# EAGLE design ESP32-LedTreiber_V110 (EAGLE 9.6.2)
AUTOREN: Hardi, Jürgen & Dominik; DATUM: 2021-04-05; PROJEKT: MLL - ESP32-Adapter; VERSION: 1.1
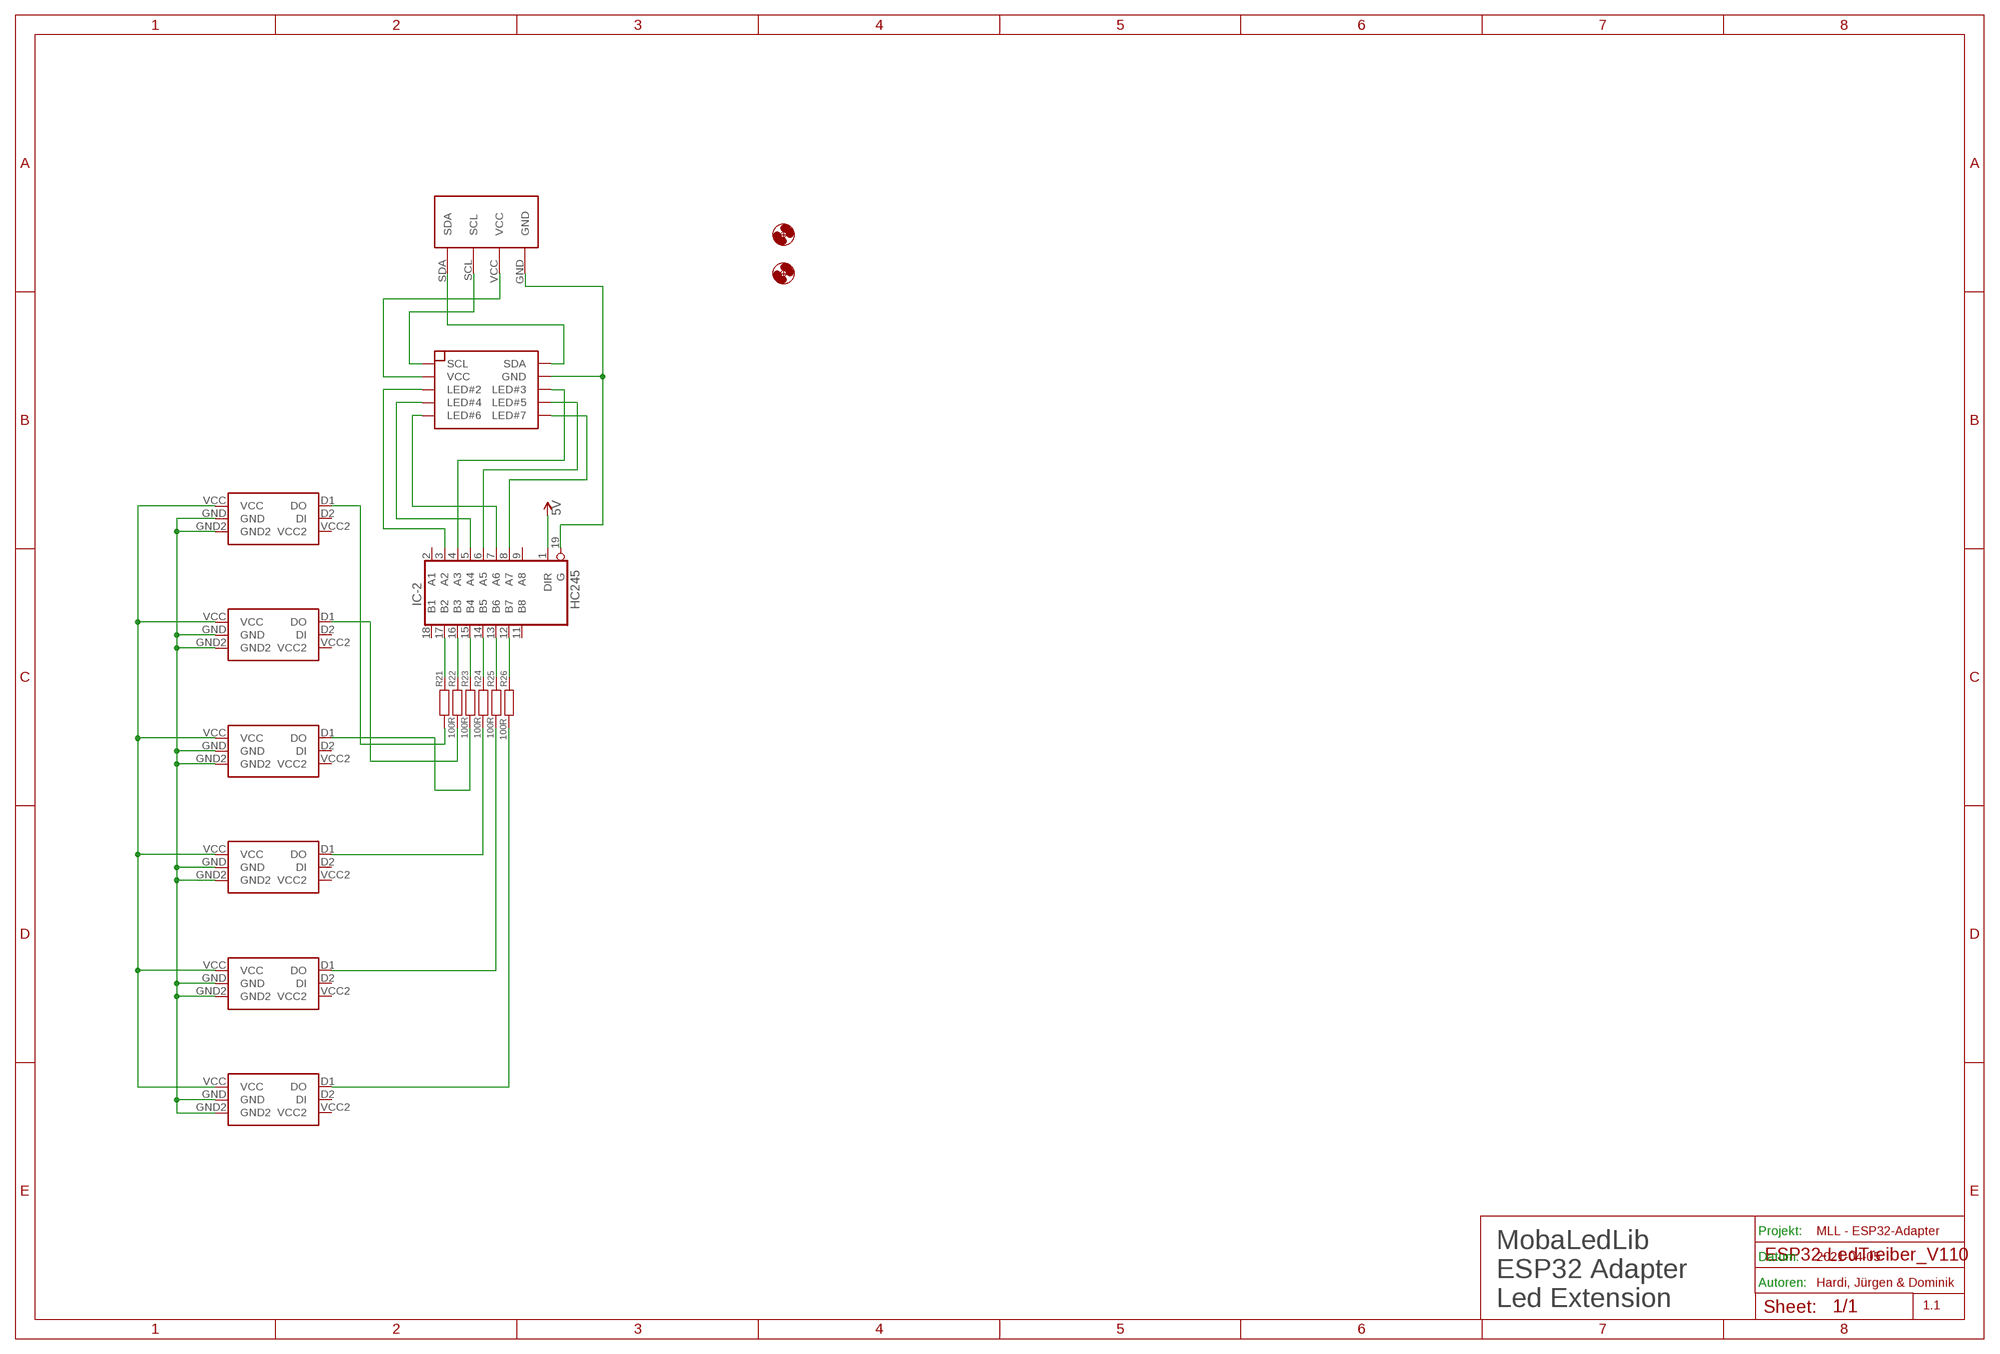
[diagram p0: schematic, sheet 1]

## Parts
H3  MOUNT-HOLE2.8  [2,8]
H4  MOUNT-HOLE2.8  [2,8]
IC-2  HC245  74AC245N  [DIL20]
LED_IN  MLL-32-EXT10  [IDC10]
OUT2A  LED-BUS-OUTPUT  [IDC6]
OUT3A  LED-BUS-OUTPUT  [IDC6]
OUT4A  LED-BUS-OUTPUT  [IDC6]
OUT5A  LED-BUS-OUTPUT  [IDC6]
OUT6A  LED-BUS-OUTPUT  [IDC6]
OUT7A  LED-BUS-OUTPUT  [IDC6]
R21  100R  RESISTOR-1/8W  [R-0.125-6,35]
R22  100R  RESISTOR-1/8W  [R-0.125-6,35]
R23  100R  RESISTOR-1/8W  [R-0.125-6,35]
R24  100R  RESISTOR-1/8W  [R-0.125-6,35]
R25  100R  RESISTOR-1/8W  [R-0.125-6,35]
R26  100R  RESISTOR-1/8W  [R-0.125-6,35]
U$7  I2C  [I2C-4]

## Nets
DO1: OUT2A.D1(DO) R21.1
DO9: OUT6A.D1(DO) R25.1
DO10: OUT5A.D1(DO) R24.1
DO11: OUT4A.D1(DO) R23.1
DO12: OUT3A.D1(DO) R22.1
GND: IC-2.19(G) LED_IN.4(GND) OUT2A.GND OUT2A.GND2 OUT3A.GND OUT3A.GND2 OUT4A.GND OUT4A.GND2 OUT5A.GND OUT5A.GND2 OUT6A.GND OUT6A.GND2 OUT7A.GND OUT7A.GND2 U$7.GND
LB#2: IC-2.3(A2) LED_IN.5(LED#2)
LB#3: IC-2.4(A3) LED_IN.6(LED#3)
LB#4: IC-2.5(A4) LED_IN.7(LED#4)
LB#5: IC-2.6(A5) LED_IN.8(LED#5)
LB#6: IC-2.7(A6) LED_IN.9(LED#6)
LB#7: IC-2.8(A7) LED_IN.10(LED#7)
N$6: OUT7A.D1(DO) R26.1
N$47: IC-2.17(B2) R21.2
N$62: IC-2.16(B3) R22.2
N$76: IC-2.15(B4) R23.2
N$77: IC-2.14(B5) R24.2
N$78: IC-2.13(B6) R25.2
N$79: IC-2.12(B7) R26.2
SCL: LED_IN.1(SCL) U$7.SCL
SDA: LED_IN.2(SDA) U$7.SDA
VCC_1: IC-2.1(DIR) LED_IN.3(VCC) OUT2A.VCC OUT3A.VCC OUT4A.VCC OUT5A.VCC OUT6A.VCC OUT7A.VCC U$7.VCC ; supply symbol labelled 5V
Unconnected: IC-2.2(A1) IC-2.9(A8) IC-2.11(B8) IC-2.18(B1) OUT2A.D2(DI) OUT3A.D2(DI) OUT4A.D2(DI) OUT5A.D2(DI) OUT6A.D2(DI) OUT7A.D2(DI)

## Notes on the sheet
- Projekt:
- Datum:
- Autoren:
- MobaLedLib 
  ESP32 Adapter
  Led Extension

## Power pins joined to a net without a drawn wire
GND: IC-2.10(GND)
VCC2: OUT2A.VCC2 OUT3A.VCC2 OUT4A.VCC2 OUT5A.VCC2 OUT6A.VCC2 OUT7A.VCC2
VCC_1: IC-2.20(VCC)

## Library data of the parts
H3 H4 = holes:MOUNT-HOLE: MOUNTING HOLE with drill center marker
IC-2 = 0 ProSaH-74xx:74*245: Octal BUS TRANSCEIVER, 3-state
LED_IN = MLL-Dominik-Hardi:MLL-32-EXT10
OUT2A OUT3A OUT4A OUT5A OUT6A OUT7A = MLL-Dominik-Hardi:LED-BUS-OUTPUT
R21-R26 = 0 ProSaH-PASSIV:RESISTOR
U$7 = MLL-Dominik-Hardi:I2C

## Board
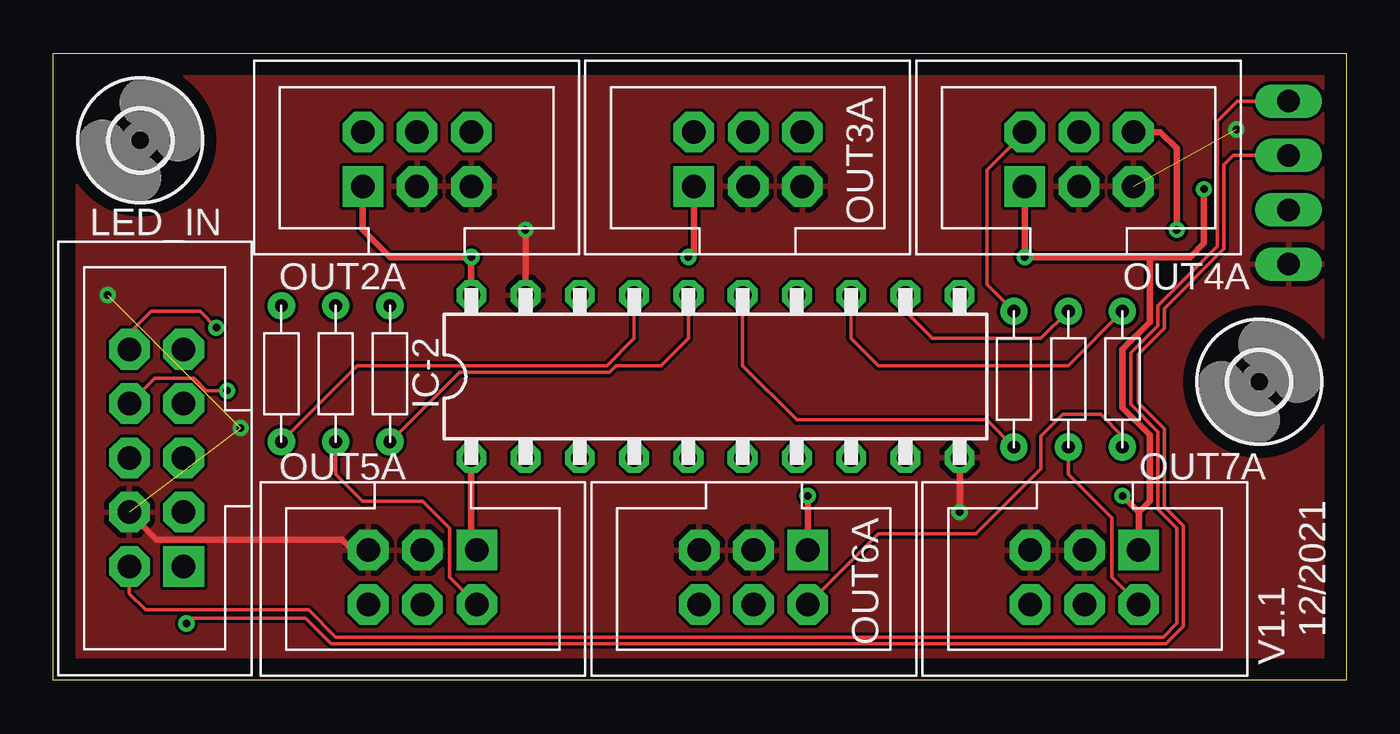
[diagram p1: board, top side]
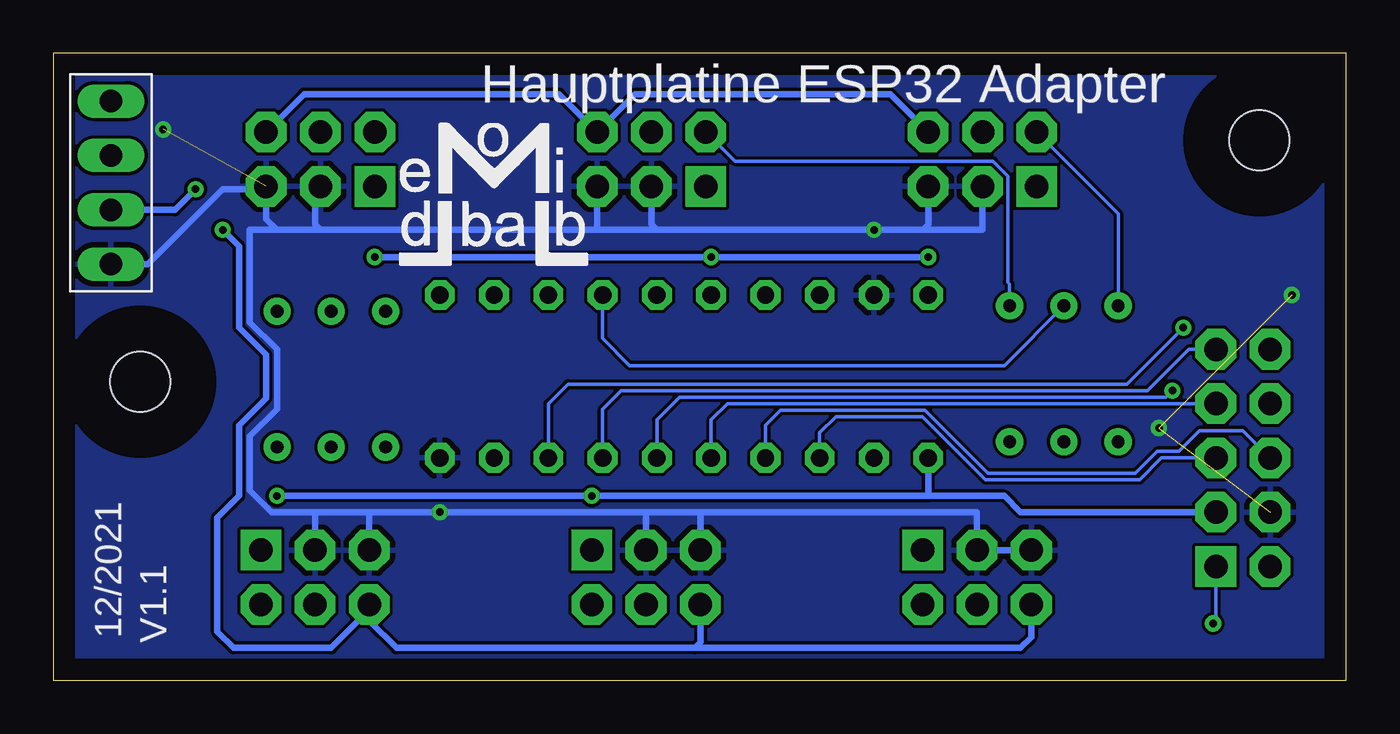
[diagram p2: board, bottom side, seen from below]

Size 60.5 x 29.34 mm. Coordinates in mm from the lower left corner, seen from the top.
Outline: 0,29.34 60.5,29.34 60.5,0 0,0 0,29.34
Copper layers (1*16): Top 0.035mm / dielectric 1.5mm / Bottom 0.035mm
Design rules "default *": minimum track width 6mil, minimum drill 0.35mm, track to track 6mil, track to pad 6mil, pad to pad 6mil, via to via 6mil, smd to smd 6mil, copper to edge 40mil, drill to drill 6mil, minimum pad ring 10mil, minimum via ring 8mil, stop-mask expansion 4mil, vias tented up to drill 0.5mm, thermal gap 10mil

### Footprints (pad centres in the part's own frame; a part is rotated, then mirrored left to right if it is on the bottom)
2,8 = hole 2.8: 0,0
DIL20 = drill 0.813 pad 1.397 octagon: 1 -11.43,-3.81; 2 -8.89,-3.81; 3 -6.35,-3.81; 4 -3.81,-3.81; 5 -1.27,-3.81; 6 1.27,-3.81; 7 3.81,-3.81; 8 6.35,-3.81; 9 8.89,-3.81; 10 11.43,-3.81; 11 11.43,3.81; 12 8.89,3.81; 13 6.35,3.81; 14 3.81,3.81; 15 1.27,3.81; 16 -1.27,3.81; 17 -3.81,3.81; 18 -6.35,3.81; 19 -8.89,3.81; 20 -11.43,3.81
IDC10 = drill 1.1 pad 1.9 square: 1 -5.08,-1.27 | drill 1.1 pad 1.9 octagon: 2 -5.08,1.27; 3 -2.54,-1.27; 4 -2.54,1.27; 5 0,-1.27; 6 0,1.27; 7 2.54,-1.27; 8 2.54,1.27; 9 5.08,-1.27; 10 5.08,1.27
IDC6 = drill 1.1 pad 1.9 octagon: D1 -2.54,1.27; D2 0,1.27; GND 0,-1.27; GND2 2.54,-1.27; VCC2 2.54,1.27 | drill 1.1 pad 1.9 square: VCC -2.54,-1.27
R-0.125-6,35 = drill 0.6 pad 1.27: 1 -3.81,0; 2 2.54,0
I2C-4 = drill 1.05 long: GND 0,-3.81; SCL 0,1.27; SDA 0,3.81; VCC 0,-1.27

### Placement (x,y rotation side)
H3  4.06,25.27 0 top
H4  56.44,13.97 0 top
IC-2  30.99,14.22 0 top
LED_IN  4.83,10.41 90 top
OUT2A  17.02,24.38 0 top
OUT3A  32.51,24.38 0 top
OUT4A  48.01,24.38 0 top
OUT5A  17.27,4.83 180 top
OUT6A  32.77,4.83 180 top
OUT7A  48.26,4.83 180 top
R21  10.67,13.72 270 top
R22  15.75,13.72 270 top
R23  44.96,13.46 270 top
R24  13.21,14.99 90 top
R25  50.04,14.73 90 top
R26  47.5,14.73 90 top
U$7  57.81,23.29 0 bottom

### Tracks (layer width: path | path; a pad name or v marks a point on that pad's centre or on a via)
DO1
  Bottom 0.152: OUT2A.D1 10.67,21.84 R21.1
DO9
  Top 0.152: OUT6A.D1 38.61,6.86 43.18,6.86 46.23,9.91 46.23,11.43 47.24,12.45 49.02,12.45 50.04,11.43 R25.1
DO10
  Top 0.152: OUT5A.D1 18.54,4.83 18.54,7.11 17.27,8.38 14.48,8.38 13.21,9.65 R24.1
DO11
  Top 0.152: R23.1 43.69,18.54 43.69,23.88 OUT4A.D1
DO12
  Bottom 0.152: OUT3A.D1 28.61,24.29 16.53,24.29 15.84,23.6 15.84,18.63 15.75,18.54 R22.1
GND  (via drill 0.35)  (3 unrouted)
  Top 0.305: IC-2.10 v42.42,7.87 | LED_IN.4 4.84,6.59 13.52,6.59 14.01,6.1 OUT5A.GND2 | v22.1,21.08 IC-2.19
  Bottom 0.305: OUT2A.GND 17.02,21.08 19.81,21.08 | 48.01,21.08 48.26,21.34 48.26,22.86 OUT4A.GND | 19.81,21.08 v22.1,21.08 32.26,21.08 | 32.26,21.08 35.05,21.08 | 35.05,21.08 48.01,21.08 | OUT3A.GND 32.51,21.34 32.26,21.08 | 50.04,21.08 51.31,21.08 51.31,16.76 50.04,15.49 50.04,12.7 51.31,11.43 51.31,8.89 50.29,7.87 48.26,7.87 | 50.04,21.08 48.01,21.08 | 50.04,21.08 50.55,21.59 OUT4A.GND2 50.67,22.99 52.58,22.99 56.08,19.48 U$7.GND | OUT3A.GND2 35.05,21.08 | OUT2A.GND2 19.56,21.34 19.81,21.08 | 45.72,7.87 v42.42,7.87 32.77,7.87 | 30.23,7.87 17.27,7.87 OUT5A.GND OUT5A.GND2 | OUT6A.GND2 30.23,7.87 | OUT6A.GND 32.77,7.87 | OUT7A.GND2 45.72,7.87 | 32.77,7.87 30.23,7.87 | 45.72,7.87 48.26,7.87 | OUT7A.GND 48.26,7.87
  other vias: 2.54,18.03 8.76,11.81 55.37,25.78
  pour Top: 0.51,29.36 60.05,29.36 60.13,0.18 0.51,0.25
  pour Bottom: 0.25,29.36 60.15,29.36 60.2,0 0.51,0.25 0.25,0.51
LB#2
  Bottom 0.152: LED_IN.5 8.64,10.41 9.65,9.4 16.89,9.4 19.84,12.34 23.88,12.34 24.64,11.58 IC-2.3
LB#3
  Bottom 0.152: LED_IN.6 4.83,11.68 6.86,11.68 7.82,10.72 8.84,10.72 9.86,9.7 16.76,9.7 19.71,12.65 26.47,12.65 27.18,11.94 IC-2.4
LB#4
  Bottom 0.152: LED_IN.7 28.96,12.95 29.72,12.19 IC-2.5
LB#5  (via drill 0.35)
  Top 0.152: v8.13,13.56 7.16,13.56 6.58,14.13 4.73,14.13 LED_IN.8
  Bottom 0.152: v8.13,13.56 8.43,13.26 31.19,13.26 32.26,12.19 IC-2.6
LB#6
  Bottom 0.152: LED_IN.9 7.37,15.49 9.3,13.56 33.93,13.56 34.8,12.7 IC-2.7
LB#7  (via drill 0.35)
  Top 0.152: LED_IN.10 3.56,16.26 4.57,17.27 6.86,17.27 v7.62,16.51
  Bottom 0.152: v7.62,16.51 10.26,13.87 36.42,13.87 37.34,12.95 IC-2.8
N$6
  Top 0.152: OUT7A.D1 49.53,4.83 49.53,7.62 47.5,9.65 R26.1
N$47
  Top 0.152: R21.2 14.22,14.73 25.91,14.73 27.18,16 IC-2.17
N$62
  Top 0.152: R22.2 19,14.43 26.03,14.43 26.34,14.73 28.45,14.73 29.72,16 IC-2.16
N$76
  Top 0.152: IC-2.15 32.26,14.73 34.8,12.19 43.69,12.19 R23.2
N$77
  Bottom 0.152: R24.2 16,14.73 33.53,14.73 34.8,16 IC-2.14
N$78
  Top 0.152: R25.2 47.5,14.73 38.61,14.73 37.34,16 IC-2.13
N$79
  Top 0.152: R26.2 46.23,16 41.15,16 39.88,17.27 IC-2.12
SCL  (via drill 0.35)
  Top 0.152: U$7.SCL 55.22,24.56 54.79,24.13 54.79,20.19 51.99,17.4 51.99,16.48 50.78,15.26 50.78,12.99 51.99,11.77 51.99,8.13 52.88,7.24 52.88,2.54 52.07,1.73 13,1.73 11.81,2.92 6.48,2.92 v6.22,2.67
  Bottom 0.152: v6.22,2.67 6.1,2.79 LED_IN.1
SDA
  Top 0.152: LED_IN.2 3.56,4.06 4.32,3.3 11.94,3.3 13.21,2.03 51.94,2.03 52.58,2.67 52.58,7.11 51.69,8 51.69,11.65 50.42,12.92 50.42,15.34 51.69,16.61 51.69,17.53 54.48,20.32 54.48,26.16 55.42,27.1 U$7.SDA
VCC2  (via drill 0.35)
  Top 0.305: v52.58,21.08 52.58,24.89 51.82,25.65 OUT4A.VCC2
  Bottom 0.305: OUT2A.VCC2 21.34,27.43 33.27,27.43 OUT3A.VCC2 36.83,27.43 48.77,27.43 OUT4A.VCC2 | OUT5A.VCC2 14.73,2.03 15.24,1.52 30.48,1.52 | 30.48,1.52 44.45,1.52 45.72,2.79 OUT7A.VCC2 45.72,3.3 47.5,1.52 52.07,1.52 52.83,2.29 52.83,7.62 52.14,8.31 51.82,8.64 51.82,11.94 50.55,13.21 50.55,15.24 51.82,16.51 51.82,20.32 v52.58,21.08 | OUT6A.VCC2 30.23,1.78 30.48,1.52
VCC_1  (via drill 0.35)
  Top 0.305: OUT4A.VCC v45.47,19.81 51.31,19.81 | OUT3A.VCC 29.97,20.07 v29.72,19.81 | OUT6A.VCC v35.31,8.64 | v50.04,8.64 50.8,7.87 | 50.8,7.87 OUT7A.VCC | 50.8,7.87 51.31,8.38 51.31,11.49 50.04,12.76 50.04,15.49 51.31,16.76 51.31,19.81 | OUT2A.VCC 14.48,21.08 15.75,19.81 v19.56,19.81 IC-2.20 | OUT5A.VCC 19.56,6.35 IC-2.1 | 51.31,19.81 53.21,19.81 53.85,20.45 v53.85,22.99
  Bottom 0.305: v19.56,19.81 v29.72,19.81 v45.47,19.81 | v50.04,8.64 v35.31,8.64 19.56,8.64 | 19.56,8.64 IC-2.1 | LED_IN.3 15.24,7.87 16,8.64 19.56,8.64 | v53.85,22.99 54.81,22.02 U$7.VCC

### Text on the board
bPlace: Hauptplatine ESP32 Adapter
tValues: 2 | 3 | 4 | 5 | 6 | 7